# Altium schematic sheet External_Memory.SchDoc
size A4
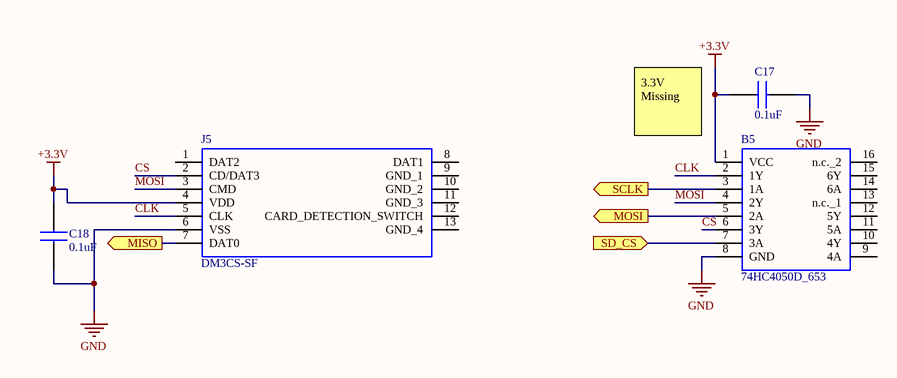
[diagram p0: External_Memory.SchDoc]

## Parts
B5  74HC4050D_653  [SOIC127P600X175-16N]
C17  0.1uF  [CAPC1005X55N]
C18  0.1uF  [CAPC1005X55N]
J5  DM3CS-SF  [DM3CS-SF]

## Ports
MISO (out), MOSI (out), SCLK (out), SD_CS (in)

## Nets
+3.3V: B5.1(VCC) C17.1 C18.2 J5.4(VDD)
GND: B5.8(GND) C17.2 C18.1 J5.6(VSS)
CLK: B5.2(1Y) J5.5(CLK)
CS: B5.6(3Y) J5.2(CD/DAT3)
MISO: J5.7(DAT0) ; port MISO
MOSI: B5.4(2Y) J5.3(CMD)
MOSI: B5.5(2A) ; port MOSI  [a separate net that carries the same name]
SCLK: B5.3(1A) ; port SCLK
SD_CS: B5.7(3A) ; port SD_CS

Not connected (* = marked no-connect by the designer): B5 9(4A) 10(4Y) 11(5A) 12(5Y) 13(n.c._1) 14(6A) 15(6Y) 16(n.c._2); J5 1(DAT2) 8(DAT1) 9(GND_1) 10(GND_2) 11(GND_3) 12(CARD_DETECTION_SWITCH) 13(GND_4)

## Notes on the sheet
- 3.3V Missing

## Library data of the parts
B5 = 74HC4050D_653: 74HC4050 - Hex non-inverting HIGH-to-LOW level shifter@en-us; Manufacturer_Name: Nexperia; Manufacturer_Part_Number: 74HC4050D,653; Geometry.Height: 1.75mm; Arrow Part Number: 74HC4050D,653; Arrow Price/Stock: https://www.arrow.com/en/products/74hc4050d653/nexperia; Mouser Part Number: 771-74HC4050D-T; Mouser Price/Stock: https://www.mouser.co.uk/ProductDetail/Nexperia/74HC4050D653?qs=P62ublwmbi%2FIblpTHxAIPw%3D%3D; Datasheet Link: https://assets.nexperia.com/documents/data-sheet/74HC4050.pdf
C17 C18 = C0402C104M4RECTU: Multilayer Ceramic Capacitors MLCC - SMD/SMT 16V 0.1uF X7R 0402 20%; Manufacturer_Name: Kemet; Geometry.Height: 0.55mm; Manufacturer_Part_Number: C0402C104M4RECTU; Arrow Part Number: C0402C104M4RECTU; Arrow Price/Stock: *; Mouser Part Number: 80-C0402C104M4RECTU; Mouser Price/Stock: https://www.mouser.com/Search/Refine.aspx?Keyword=80-C0402C104M4RECTU; Datasheet Link: https://content.kemet.com/datasheets/KEM_C1002_X7R_SMD.pdf
J5 = DM3CS-SF: MicroSD card connector, push-pull type MicroSD card connector, push-pull type; Manufacturer_Name: Hirose; Manufacturer_Part_Number: DM3CS-SF; Arrow Part Number: DM3CS-SF; Arrow Price/Stock: https://www.arrow.com/en/products/dm3cs-sf/hirose-electric; Mouser Part Number: 798-DM3CSSF; Mouser Price/Stock: https://www.mouser.co.uk/ProductDetail/Hirose-Connector/DM3CS-SF?qs=tTj%252BmQ3KZwbB9K5zh89Rcw%3D%3D; Datasheet Link: http://docs-emea.rs-online.com/webdocs/118f/0900766b8118f8bb.pdf